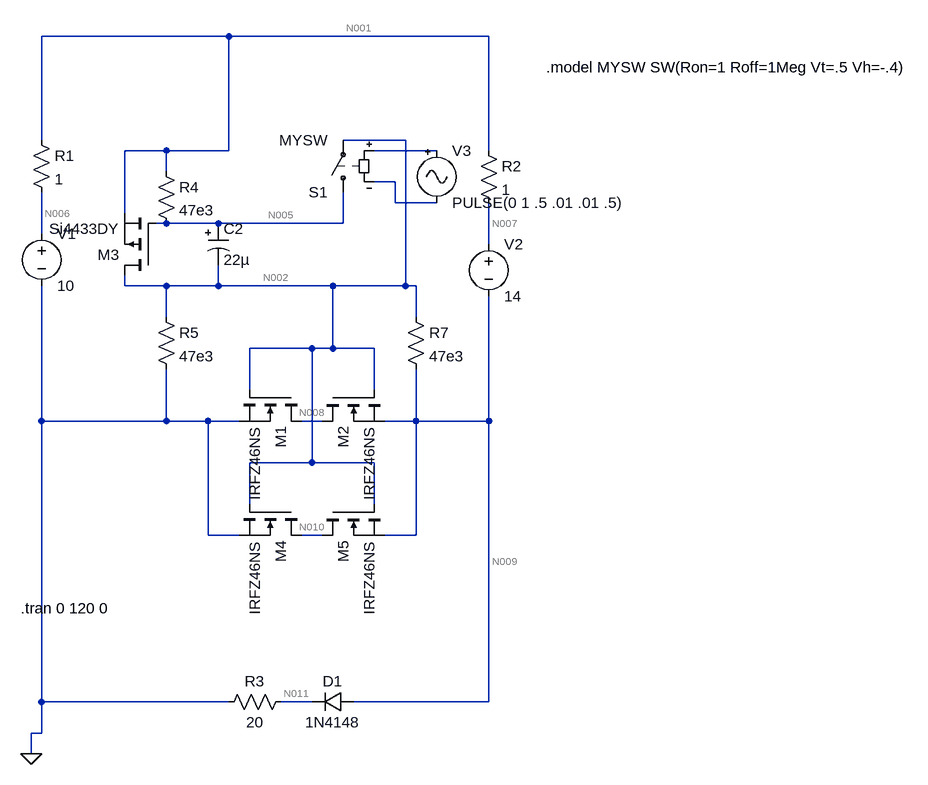
[diagram p0: schematic Draft1.asc]
Draft1.asc, the LTspice schematic file:
Version 4
SHEET 1 1364 1028
WIRE 272 -96 -16 -96
WIRE 672 -96 272 -96
WIRE -16 64 -16 -96
WIRE 544 64 448 64
WIRE 176 80 112 80
WIRE 272 80 272 -96
WIRE 272 80 176 80
WIRE 592 80 496 80
WIRE 672 80 672 -96
WIRE 176 112 176 80
WIRE 528 128 496 128
WIRE 528 160 528 128
WIRE 592 160 528 160
WIRE 112 176 112 80
WIRE 176 192 160 192
WIRE 256 192 176 192
WIRE 448 192 448 144
WIRE 448 192 256 192
WIRE -16 208 -16 144
WIRE 672 224 672 160
WIRE 112 288 112 272
WIRE 176 288 112 288
WIRE 256 288 256 256
WIRE 256 288 176 288
WIRE 432 288 256 288
WIRE 544 288 544 64
WIRE 544 288 432 288
WIRE 560 288 544 288
WIRE 176 336 176 288
WIRE 560 336 560 288
WIRE 400 384 304 384
WIRE 432 384 432 288
WIRE 432 384 400 384
WIRE 496 384 432 384
WIRE 304 448 304 384
WIRE 496 448 496 384
WIRE -16 496 -16 288
WIRE 176 496 176 416
WIRE 176 496 -16 496
WIRE 240 496 176 496
WIRE 288 496 240 496
WIRE 416 496 384 496
WIRE 560 496 560 416
WIRE 560 496 512 496
WIRE 672 496 672 304
WIRE 672 496 560 496
WIRE 400 560 400 384
WIRE 400 560 304 560
WIRE 496 560 400 560
WIRE 304 624 304 560
WIRE 496 624 496 560
WIRE 240 672 240 496
WIRE 288 672 240 672
WIRE 416 672 384 672
WIRE 560 672 560 496
WIRE 560 672 512 672
WIRE -16 928 -16 496
WIRE 272 928 -16 928
WIRE 400 928 352 928
WIRE 672 928 672 496
WIRE 672 928 464 928
WIRE -16 976 -16 928
WIRE -16 976 -32 976
WIRE -32 1008 -32 976
FLAG -32 1008 0
SYMBOL voltage -16 192 R0
WINDOW 123 0 0 Left 0
WINDOW 39 0 0 Left 0
SYMATTR InstName V1
SYMATTR Value 10
SYMBOL voltage 672 208 R0
WINDOW 123 0 0 Left 0
WINDOW 39 0 0 Left 0
SYMATTR InstName V2
SYMATTR Value 14
SYMBOL res -32 48 R0
SYMATTR InstName R1
SYMATTR Value 1
SYMBOL res 656 64 R0
SYMATTR InstName R2
SYMATTR Value 1
SYMBOL nmos 384 448 R90
SYMATTR InstName M1
SYMATTR Value IRFZ46NS
SYMBOL diode 464 912 R90
WINDOW 0 0 32 VBottom 2
WINDOW 3 32 32 VTop 2
SYMATTR InstName D1
SYMATTR Value 1N4148
SYMBOL res 368 912 R90
WINDOW 0 0 56 VBottom 2
WINDOW 3 32 56 VTop 2
SYMATTR InstName R3
SYMATTR Value 20
SYMBOL nmos 416 448 M90
SYMATTR InstName M2
SYMATTR Value IRFZ46NS
SYMBOL Misc\\signal 592 64 R0
WINDOW 123 0 0 Left 0
WINDOW 39 0 0 Left 0
SYMATTR InstName V3
SYMATTR Value PULSE(0 1 .5 .01 .01 .5)
SYMBOL sw 448 160 R180
SYMATTR InstName S1
SYMATTR Value MYSW
SYMBOL res 160 320 R0
SYMATTR InstName R5
SYMATTR Value 47e3
SYMBOL res 544 320 R0
SYMATTR InstName R7
SYMATTR Value 47e3
SYMBOL polcap 240 192 R0
WINDOW 3 24 56 Left 2
SYMATTR InstName C2
SYMATTR Value 22µ
SYMATTR Description Capacitor
SYMATTR Type cap
SYMATTR SpiceLine V=50 Irms=130m Rser=0.721604 Lser=3.65781n mfg="Würth Elektronik" pn="860240673003 WCAP-AT1H 6,3x11" type="Al electrolytic"
SYMBOL pmos 160 272 R180
SYMATTR InstName M3
SYMATTR Value Si4433DY
SYMBOL res 160 96 R0
SYMATTR InstName R4
SYMATTR Value 47e3
SYMBOL nmos 384 624 R90
SYMATTR InstName M4
SYMATTR Value IRFZ46NS
SYMBOL nmos 416 624 M90
SYMATTR InstName M5
SYMATTR Value IRFZ46NS
TEXT 760 -48 Left 2 !.model MYSW SW(Ron=1 Roff=1Meg Vt=.5 Vh=-.4)
TEXT -48 784 Left 2 !.tran 0 120 0

The netlist it stands for:
* Draft1.asc
V1 N006 0 10
V2 N007 N009 14
R1 N001 N006 1
R2 N001 N007 1
M1 N008 N002 0 0 IRFZ46NS
D1 N009 N011 1N4148
R3 N011 0 20
M2 N008 N002 N009 N009 IRFZ46NS
V3 N003 N004 PULSE(0 1 .5 .01 .01 .5)
S1 N005 N002 N003 N004 MYSW
R5 N002 0 47e3
R7 N002 N009 47e3
C2 N005 N002 22µ V=50 Irms=130m Rser=0.721604 Lser=3.65781n mfg="Würth Elektronik" pn="860240673003 WCAP-AT1H 6,3x11" type="Al electrolytic"
M3 N002 N005 N001 N001 Si4433DY
R4 N001 N005 47e3
M4 N010 N002 0 0 IRFZ46NS
M5 N010 N002 N009 N009 IRFZ46NS
.model D D
.lib standard.dio
.model NMOS NMOS
.model PMOS PMOS
.lib standard.mos
.model MYSW SW(Ron=1 Roff=1Meg Vt=.5 Vh=-.4)
.tran 0 120 0
.backanno
.end

* Results of the author's LTspice run, read from the files saved beside the schematic
* Operating Point, zero values left out:
*   V(n006) = 10 V
*   V(n007) = 10 V
*   V(n009) = -4 V
*   V(n001) = 10 V
*   V(n008) = -17.93 mV
*   V(n002) = -1.732 V
*   V(n011) = -50.48 nV
*   V(n005) = 9.473 V
*   V(n010) = -17.93 mV
*   Id(M3) = -212.3 nA
*   Is(M3) = 212.3 nA
*   Id(M5) = 350 nA
*   Is(M5) = -350 nA
*   Id(M4) = -350 nA
*   Is(M4) = 350 nA
*   Id(M2) = 350 nA
*   Is(M2) = -350 nA
*   Id(M1) = -350 nA
*   Is(M1) = 350 nA
*   I(D1) = -2.524 nA
*   I(R4) = 11.21 µA
*   I(R7) = 48.26 µA
*   I(R5) = -36.84 µA
*   I(R3) = -2.524 nA
*   I(R2) = -48.96 µA
*   I(R1) = 37.55 µA
*   I(S1) = -11.21 µA
*   I(V2) = -48.96 µA
*   I(V1) = 37.55 µA